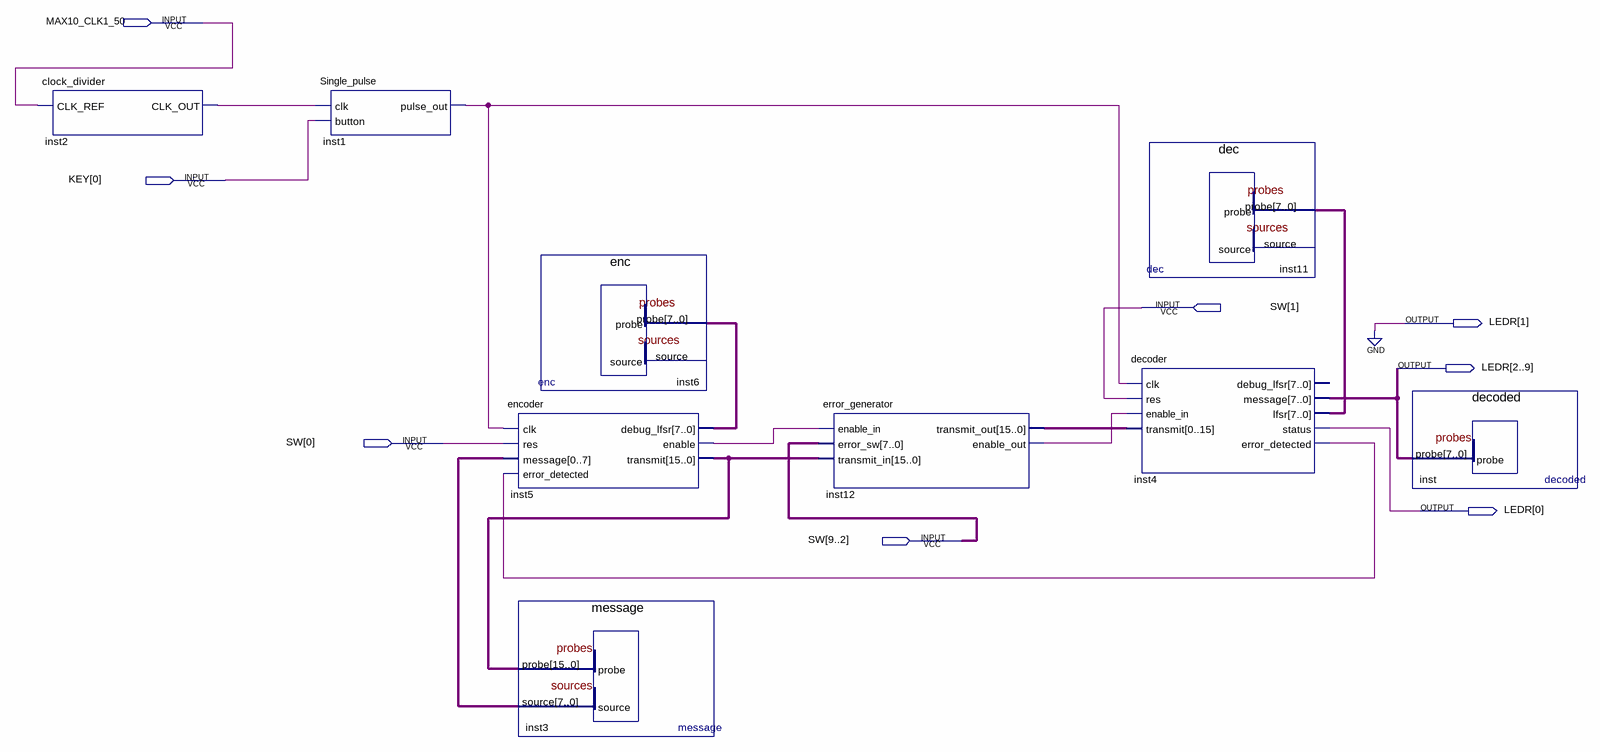
[diagram p0: schematic sheet]
// Quartus schematic topblock.bdf as structural Verilog: 9 symbols, 8 pins
module topblock (
  input  MAX10_CLK1_50,
  input  [0:0] KEY,
  input  [9:0] SW,
  output [0:9] LEDR
);

  wire inst1_pulse_out, inst2_clk_out, inst4_error_detected, inst5_enable, inst12_enable_out;
  wire [7:0] inst3_source, inst4_lfsr, inst5_debug_lfsr;
  wire [15:0] inst5_transmit, inst12_transmit_out;

  clock_divider inst2 (.CLK_REF(MAX10_CLK1_50), .CLK_OUT(inst2_clk_out));
  Single_pulse inst1 (.clk(inst2_clk_out), .button(KEY[0]), .pulse_out(inst1_pulse_out));
  enc inst6 (.probe(inst5_debug_lfsr));  // open: source
  encoder inst5 (
    .clk(inst1_pulse_out), .res(SW[0]), .message(inst3_source), .error_detected(inst4_error_detected),
    .debug_lfsr(inst5_debug_lfsr), .enable(inst5_enable), .transmit(inst5_transmit));
  message inst3 (.probe(inst5_transmit), .source(inst3_source));
  error_generator inst12 (
    .enable_in(inst5_enable), .error_sw(SW[9:2]), .transmit_in(inst5_transmit),
    .transmit_out(inst12_transmit_out), .enable_out(inst12_enable_out));
  dec inst11 (.probe(inst4_lfsr));  // open: source
  decoder inst4 (
    .clk(inst1_pulse_out), .res(SW[1]), .enable_in(inst12_enable_out), .transmit(inst12_transmit_out),
    .message(LEDR[2:9]), .lfsr(inst4_lfsr), .status(LEDR[0]), .error_detected(inst4_error_detected));  // open: debug_lfsr
  decoded inst (.probe(LEDR[2:9]));

  assign LEDR[1] = 1'b0;
endmodule
